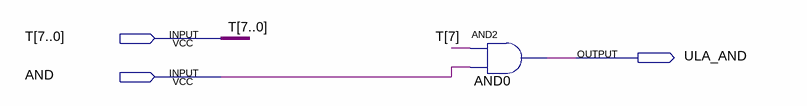
[diagram p0: schematic sheet]
// Quartus schematic ULA_AND.bdf as structural Verilog: 1 symbols, 3 pins
module ULA_AND (
  input  [7:0] T,
  input  AND,
  output ULA_AND
);

  and AND0 (ULA_AND, T[7], AND);
endmodule
